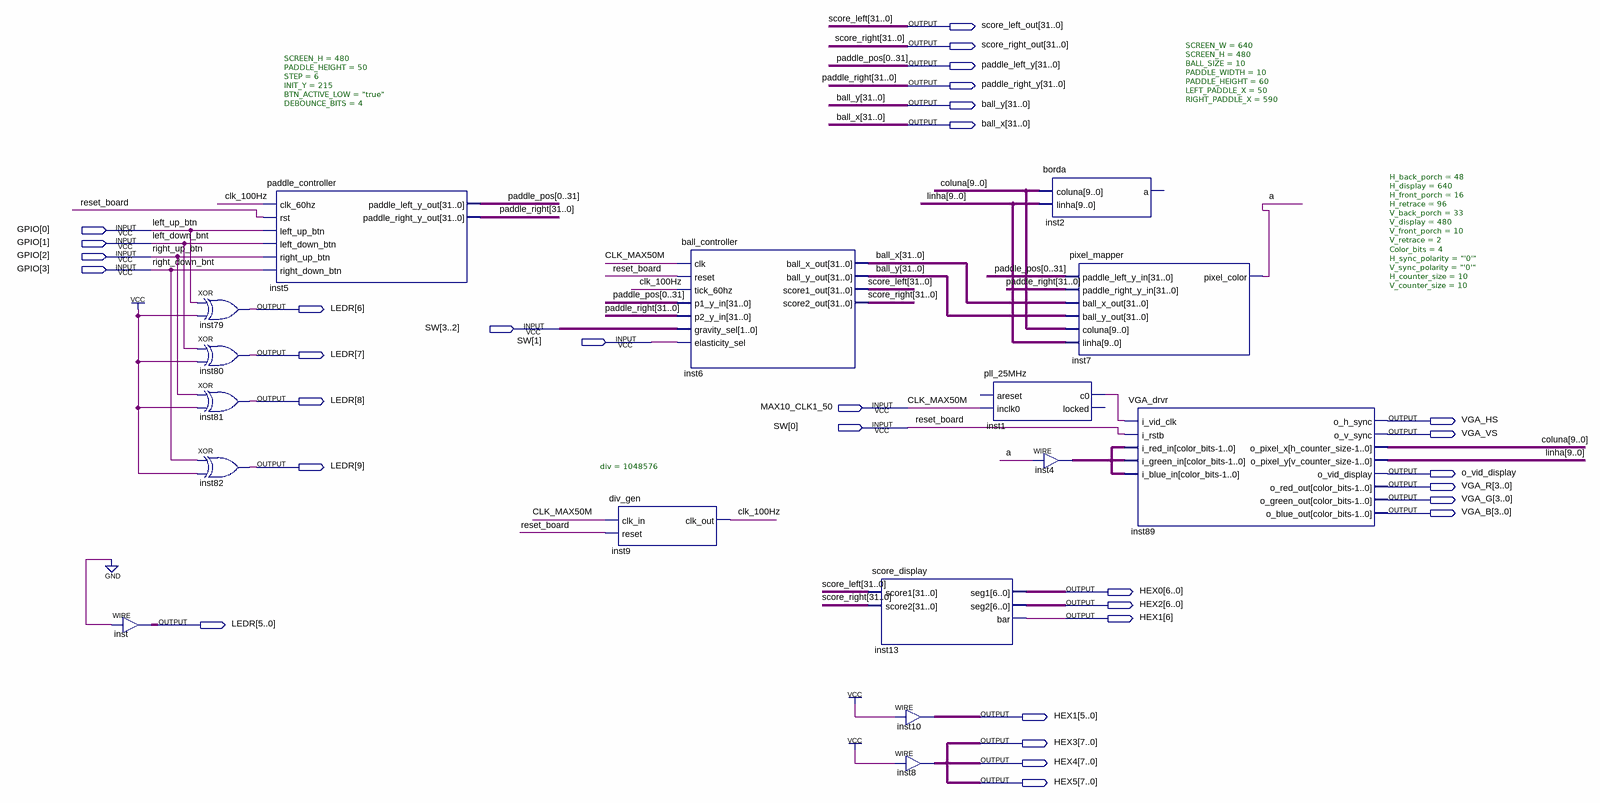
[diagram p0: schematic sheet]
// Quartus schematic vga1.bdf as structural Verilog: 16 symbols, 32 pins
module vga1 (
  input  [3:0] GPIO,
  input  [3:0] SW,
  input  MAX10_CLK1_50,
  output [31:0] score_left_out,
  output [31:0] score_right_out,
  output [31:0] paddle_left_y,
  output [31:0] paddle_right_y,
  output [31:0] ball_y,
  output [31:0] ball_x,
  output [9:0] LEDR,
  output VGA_HS,
  output VGA_VS,
  output o_vid_display,
  output [3:0] VGA_R,
  output [3:0] VGA_G,
  output [3:0] VGA_B,
  output [6:0] HEX0,
  output [6:0] HEX2,
  output [6:0] HEX1,
  output [7:0] HEX3,
  output [7:0] HEX4,
  output [7:0] HEX5
);

  wire a, clk_100Hz, inst1_c0;
  wire [3:0] inst4_out;
  wire [9:0] coluna, linha;

  assign LEDR[5:0] = {6{1'b0}};  // WIRE inst
  xor inst79 (LEDR[6], GPIO[0], 1'b1);
  xor inst80 (LEDR[7], GPIO[1], 1'b1);
  xor inst81 (LEDR[8], GPIO[2], 1'b1);
  xor inst82 (LEDR[9], GPIO[3], 1'b1);
  paddle_controller #(.SCREEN_H(480), .PADDLE_HEIGHT(50), .STEP(6), .INIT_Y(215), .BTN_ACTIVE_LOW("true"), .DEBOUNCE_BITS(4)) inst5 (
    .clk_60hz(clk_100Hz), .rst(SW[0]), .left_up_btn(GPIO[0]), .left_down_btn(GPIO[1]),
    .right_up_btn(GPIO[2]), .right_down_btn(GPIO[3]), .paddle_left_y_out(paddle_left_y),
    .paddle_right_y_out(paddle_right_y));
  div_gen #(.div(1048576)) inst9 (.clk_in(MAX10_CLK1_50), .reset(SW[0]), .clk_out(clk_100Hz));
  ball_controller inst6 (
    .clk(MAX10_CLK1_50), .reset(SW[0]), .tick_60hz(clk_100Hz), .p1_y_in(paddle_left_y),
    .p2_y_in(paddle_right_y), .gravity_sel(SW[3:2]), .elasticity_sel(SW[1]), .ball_x_out(ball_x),
    .ball_y_out(ball_y), .score1_out(score_left_out), .score2_out(score_right_out));
  score_display inst13 (.score1(score_left_out), .score2(score_right_out), .seg1(HEX0), .seg2(HEX2), .bar(HEX1[6]));
  assign HEX1[5:0] = {6{1'b1}};  // WIRE inst10
  assign HEX3 = {8{1'b1}};  // WIRE inst8
  pll_25MHz inst1 (.inclk0(MAX10_CLK1_50), .c0(inst1_c0));  // open: areset, locked
  borda inst2 (.coluna(coluna), .linha(linha));  // open: a
  pixel_mapper #(.SCREEN_W(640), .SCREEN_H(480), .BALL_SIZE(10), .PADDLE_WIDTH(10), .PADDLE_HEIGHT(60), .LEFT_PADDLE_X(50), .RIGHT_PADDLE_X(590)) inst7 (
    .paddle_left_y_in(paddle_left_y), .paddle_right_y_in(paddle_right_y), .ball_x_out(ball_x),
    .ball_y_out(ball_y), .coluna(coluna), .linha(linha), .pixel_color(a));
  assign inst4_out = {4{a}};  // WIRE inst4
  VGA_drvr #(.H_back_porch(48), .H_display(640), .H_front_porch(16), .H_retrace(96), .V_back_porch(33), .V_display(480), .V_front_porch(10), .V_retrace(2), .Color_bits(4), .H_sync_polarity("'0'"), .V_sync_polarity("'0'"), .H_counter_size(10), .V_counter_size(10)) inst89 (
    .i_vid_clk(inst1_c0), .i_rstb(SW[0]), .i_red_in(inst4_out), .i_green_in(inst4_out),
    .i_blue_in(inst4_out), .o_h_sync(VGA_HS), .o_v_sync(VGA_VS), .o_pixel_x(coluna), .o_pixel_y(linha),
    .o_vid_display(o_vid_display), .o_red_out(VGA_R), .o_green_out(VGA_G), .o_blue_out(VGA_B));

  assign HEX4 = HEX3;
  assign HEX5 = HEX3;

  // Other names for the same wires on the sheet: CLK_MAX50M = MAX10_CLK1_50; right_up_btn = GPIO[2];
  //   right_down_bnt = GPIO[3]; left_down_bnt = GPIO[1]; left_up_btn = GPIO[0];
  //   paddle_pos[31:0] = {paddle_left_y[0], paddle_left_y[1], paddle_left_y[2], paddle_left_y[3], paddle_left_y[4], paddle_left_y[5], paddle_left_y[6], paddle_left_y[7], paddle_left_y[8], paddle_left_y[9], paddle_left_y[10], paddle_left_y[11], paddle_left_y[12], paddle_left_y[13], paddle_left_y[14], paddle_left_y[15], paddle_left_y[16], paddle_left_y[17], paddle_left_y[18], paddle_left_y[19], paddle_left_y[20], paddle_left_y[21], paddle_left_y[22], paddle_left_y[23], paddle_left_y[24], paddle_left_y[25], paddle_left_y[26], paddle_left_y[27], paddle_left_y[28], paddle_left_y[29], paddle_left_y[30], paddle_left_y[31]};
  //   paddle_right[31:0] = paddle_right_y; reset_board = SW[0]; score_left[31:0] = score_left_out;
  //   score_right[31:0] = score_right_out
endmodule
